# Altium schematic sheet HAE_HMI.SchDoc
size A; SheetNumber: 6; SheetTotal: 6
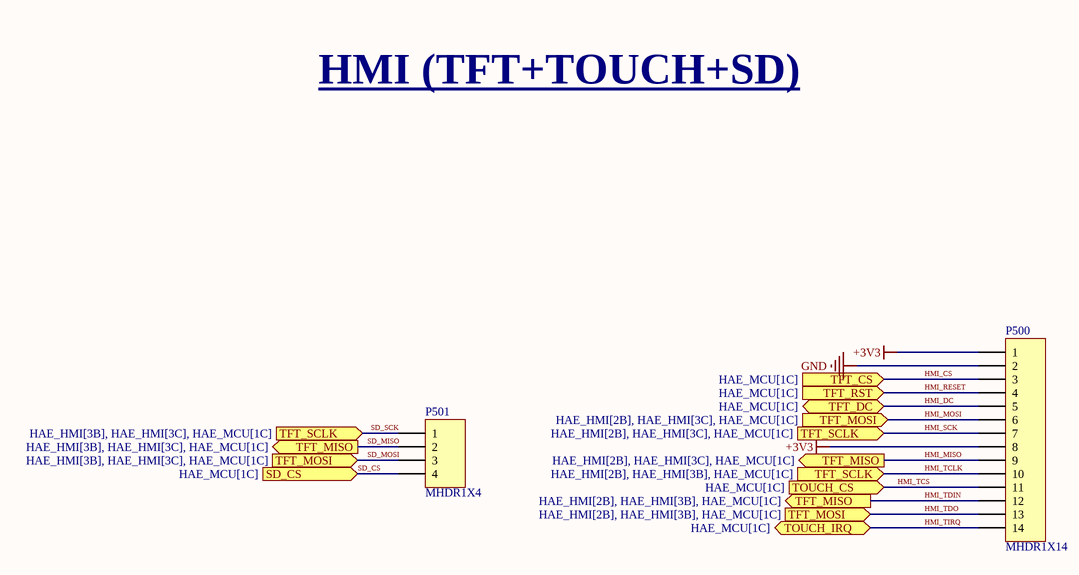
[diagram p0: HAE_HMI.SchDoc]

## Parts
P500  MHDR1X14  [MHDR1X14]
P501  MHDR1X4  [MHDR1X4]

## Ports
SD_CS (in, see HAE_MCU[1C]), TFT_CS (in, see HAE_MCU[1C]), TFT_DC (bidir, see HAE_MCU[1C]), TFT_MISO (out, see HAE_HMI[2B], HAE_HMI[3B], HAE_MCU[1C]), TFT_MISO (out, see HAE_HMI[2B], HAE_HMI[3C], HAE_MCU[1C]), TFT_MISO (out, see HAE_HMI[3B], HAE_HMI[3C], HAE_MCU[1C]), TFT_MOSI (in, see HAE_HMI[2B], HAE_HMI[3B], HAE_MCU[1C]), TFT_MOSI (in, see HAE_HMI[2B], HAE_HMI[3C], HAE_MCU[1C]), TFT_MOSI (in, see HAE_HMI[3B], HAE_HMI[3C], HAE_MCU[1C]), TFT_RST (in, see HAE_MCU[1C]), TFT_SCLK (in, see HAE_HMI[2B], HAE_HMI[3B], HAE_MCU[1C]), TFT_SCLK (in, see HAE_HMI[2B], HAE_HMI[3C], HAE_MCU[1C]), TFT_SCLK (in, see HAE_HMI[3B], HAE_HMI[3C], HAE_MCU[1C]), TOUCH_CS (in, see HAE_MCU[1C]), TOUCH_IRQ (bidir, see HAE_MCU[1C])

## Nets
+3V3: P500.1 P500.8
GND: P500.2
HMI_CS: P500.3 ; port TFT_CS
HMI_DC: P500.5 ; port TFT_DC
HMI_MISO: P500.9 P500.12 P501.2 ; port TFT_MISO  [also labelled HMI_TDIN, SD_MISO]
HMI_MOSI: P500.6 P500.13 P501.3 ; port TFT_MOSI  [also labelled HMI_TDO, SD_MOSI]
HMI_RESET: P500.4 ; port TFT_RST
HMI_SCK: P500.7 P500.10 P501.1 ; port TFT_SCLK  [also labelled HMI_TCLK, SD_SCK]
HMI_TCS: P500.11 ; port TOUCH_CS
HMI_TIRQ: P500.14 ; port TOUCH_IRQ
SD_CS: P501.4 ; port SD_CS

## Notes on the sheet
- HMI (TFT+TOUCH+SD)

## Library data of the parts
P500 = MHDR1X14: Header, 14-Pin; LatestRevisionDate: 17-Jul-2002; LatestRevisionNote: Re-released for DXP Platform.; Publisher: Altium Limited
P501 = MHDR1X4: Header, 4-Pin; LatestRevisionDate: 17-Jul-2002; LatestRevisionNote: Re-released for DXP Platform.; Publisher: Altium Limited